# EAGLE design LEDBox (EAGLE 9.1.3)
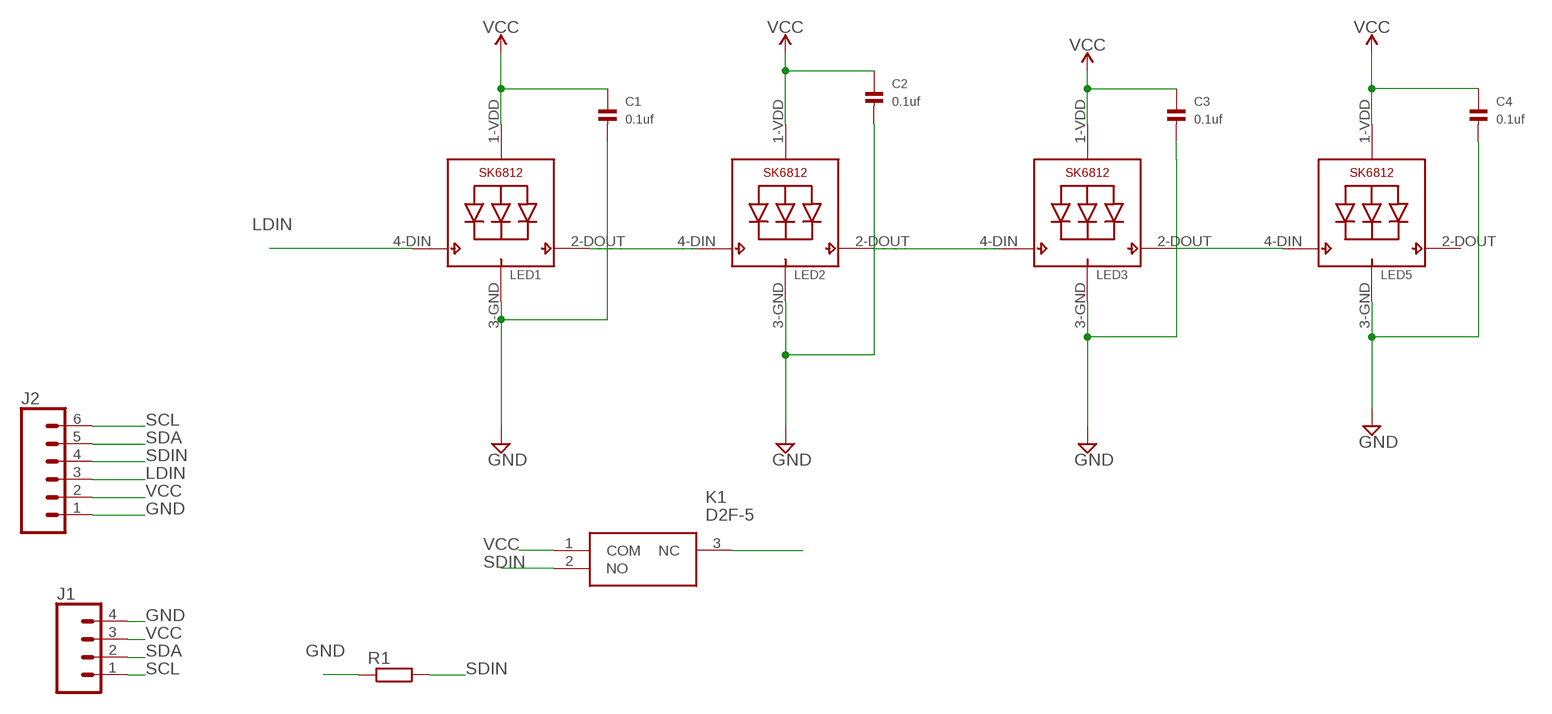
[diagram p0: schematic, sheet 1]

## Parts
C1  0.1uf  CAP_CERAMIC1206  [1206]
C2  0.1uf  CAP_CERAMIC1206  [1206]
C3  0.1uf  CAP_CERAMIC1206  [1206]
C4  0.1uf  CAP_CERAMIC1206  [1206]
J1  CONN_041X04_NO_SILK  [1X04_NO_SILK]
J2  CONN_06SMD-1MM  [1X06-1MM]
K1  D2F-5  [SHDR3W100P0X508_1X3_1280X580X5]
LED1  SK6812_5050  [LED5050]
LED2  SK6812_5050  [LED5050]
LED3  SK6812_5050  [LED5050]
LED5  SK6812_5050  [LED5050]
R1  RR3216  [R3216]

## Nets
GND: C1.2 C2.2 C3.2 C4.2 J1.4 J2.1 LED1.3-GND(GND) LED2.3-GND(GND) LED3.3-GND(GND) LED5.3-GND(GND) R1.1
LDIN: J2.3 LED1.4-DIN(DI)
N$1: LED1.2-DOUT(DO) LED2.4-DIN(DI)
N$2: LED2.2-DOUT(DO) LED3.4-DIN(DI)
N$3: LED3.2-DOUT(DO) LED5.4-DIN(DI)
N$6: K1.3(NC)
SCL: J1.1 J2.6
SDA: J1.2 J2.5
SDIN: J2.4 K1.2(NO) R1.2
VCC: C1.1 C2.1 C3.1 C4.1 J1.3 J2.2 K1.1(COM) LED1.1-VDD(VDD) LED2.1-VDD(VDD) LED3.1-VDD(VDD) LED5.1-VDD(VDD)
Unconnected: LED5.2-DOUT(DO)

## Library data of the parts
C1-C4 = microbuilder:CAP_CERAMIC: Ceramic Capacitors 0402 - 0402 Surface Mount Capacitors 16pF 50V 5% [Digikey: 445-4899-2-ND] 18pF 50V 5% [Digikey: 490-1281-2-ND] 22pF 50V 5% [Digikey: 490-1283-2-ND] 68pF 50V 5% [Digikey: 490-1289-2-ND] 0.1uF 10V 10% [Digikey: 490-1318-2-ND] 1.0uF 6.3V 10% [Digikey: 490-1320-2-ND] 0603 - 0603 Surface Mount Capacitors 16 pF 50V 5% [Digikey: 445-5051-2-ND] 22 pF 50V [Digikey: PCC220ACVTR-ND] 33 pF 50V 5% [Digikey: 490-1415-1-ND] 56pF 50V 5% [Digikey: 490-1421-1-ND] 220pF 50V 5% [Digikey: 445-1285-1-ND] 680 pF 50V 2200 pF 50V 5% C0G [Digikey: 445-1297-1-ND] 5600 pF 100V 5% X7R [Digikey: 478-3711-1-ND] 0.1 µF 25V 10% [Digikey: PCC2277TR-ND] 0.22 µF 16V 10% X7R [Digikey: 445-1318-1-ND] 1.0 µF 25V 10% [Digikey: 445-5146-2-ND] 0603 - RF Specific 3pF 250V +/-0.1pF RF [Digikey: 712-1347-1-ND] 18 pF 250V 5% [Digikey: 478-3505-1-ND or 712-1322-1-ND] 56 pF 250V 5% C0G RF [Digikey: 490-4867-1-ND] 68 pF 250V RF [Digikey: 490-4868-1-ND] 0805 - 0805 Surface Mount Capacitors 220 pF 250V 2% RF Ceramic Capacitor [Digikey: 712-1398-1-ND] 1000 pF 50V 2% NP0 Ceramic Capacitor [Digikey: 478-3760-1-ND] 0.1 µF 25V 10% Ceramic Capacitor [Digikey: PCC1828TR-ND] 1.0 µF 16V 10% Ceramic Capacitor[Digikey: 490-1691-2-ND] 10.0 µF 10V 10% Ceramic Capacitor[Digikey: 709-1228-1-ND] 10.0 uF 16V 10% Ceramic Capacitor [Digikey: 478-5165-2-ND] 47 uF 6.3V 20% Ceramic Capacitor [Digikey: 587-1779-1-ND or 399-5506-1-ND] 1206 - 1206 Surface Mount Capacitors 47uF 10V 20% Ceramic Capacitor [Digikey: 490-5528-1-ND or 399-5508-1-ND or 445-6010-1-ND] 100uF 6.3V -20%, +80% Y5V Ceramic Capacitor (Digikey: 490-4512-1-ND, Mouser: 81-GRM31CF50J107ZE1L)
J1 = SparkFun-Connectors:CONN_04: Multi connection point. Often used as Generic Header-pin footprint for 0.1 inch spaced/style header connections On any of the 0.1 inch spaced packages, you can populate with these: Break Away Headers - Straight <https://www.sparkfun.com/products/116> (PRT-00116) Break Away Male Headers - Right Angle <https://www.sparkfun.com/products/553> (PRT-00553) Female Headers <https://www.sparkfun.com/products/115> (PRT-00115) Break Away Headers - Machine Pin <https://www.sparkfun.com/products/117> (PRT-00117) Break Away Female Headers - Swiss Machine Pin <https://www.sparkfun.com/products/743> (PRT-00743) For SCREWTERMINALS and SPRING TERMINALS visit here: Screw Terimnals on SparkFun.com <https://www.sparkfun.com/search/results?term=Screw+Terminals> (5mm/3.5mm/2.54mm spacing) This device is also useful as a general connection point to wire up your design to another part of your project. Our various solder wires solder well into these plated through hole pads. Hook-Up Wire - Assortment (Stranded, 22 AWG) <https://www.sparkfun.com/products/11375> (PRT-11375) Hook-Up Wire - Assortment (Solid Core, 22 AWG) <https://www.sparkfun.com/products/11367> (PRT-11367) View the entire wire category on our website here <https://www.sparkfun.com/categories/141> Special notes: Molex polarized connector foot print use with SKU : PRT-08231 with associated crimp pins and housings. 1MM SMD Version SKU: PRT-10208; PROD_ID: CONN-09696
J2 = SparkFun-Connectors:CONN_06: Multi connection point. Often used as Generic Header-pin footprint for 0.1 inch spaced/style header connections On any of the 0.1 inch spaced packages, you can populate with these: Break Away Headers - Straight <https://www.sparkfun.com/products/116> (PRT-00116) Break Away Male Headers - Right Angle <https://www.sparkfun.com/products/553> (PRT-00553) Female Headers <https://www.sparkfun.com/products/115> (PRT-00115) Break Away Headers - Machine Pin <https://www.sparkfun.com/products/117> (PRT-00117) Break Away Female Headers - Swiss Machine Pin <https://www.sparkfun.com/products/743> (PRT-00743) Arduino Stackable Header - 6 Pin <https://www.sparkfun.com/products/9280> (PRT-09280) For SCREWTERMINALS and SPRING TERMINALS visit here: Screw Terimnals on SparkFun.com <https://www.sparkfun.com/search/results?term=Screw+Terminals> (5mm/3.5mm/2.54mm spacing) This device is also useful as a general connection point to wire up your design to another part of your project. Our various solder wires solder well into these plated through hole pads. Hook-Up Wire - Assortment (Stranded, 22 AWG) <https://www.sparkfun.com/products/11375> (PRT-11375) Hook-Up Wire - Assortment (Solid Core, 22 AWG) <https://www.sparkfun.com/products/11367> (PRT-11367) View the entire wire category on our website here <https://www.sparkfun.com/categories/141>; PROD_ID: CONN-08249; SF_ID: GPS-00579
K1 = D2F-5:D2F-5: OMRON ELECTRONIC COMPONENTS - D2F-5 - MICROSWITCH, PLUNGER, SPDT, 5A, 250V, TH Source: Datasheet <http://omronfs.omron.com/en_US/ecb/products/pdf/en-d2f.pdf>; ALLIED_NUMBER: 71203873; ALLIED_PRICE-STOCK: https://www.alliedelec.com/omron-electronic-components-d2f-5/71203873/; DESCRIPTION: OMRON ELECTRONIC COMPONENTS - D2F-5 - MICROSWITCH, PLUNGER, SPDT, 5A, 250V, TH; HEIGHT: 5.8mm; MANUFACTURER_NAME: Omron Electronics; MANUFACTURER_PART_NUMBER: D2F-5; MOUSER_PART_NUMBER: 653-D2F-5; MOUSER_PRICE-STOCK: https://www.mouser.com/Search/Refine.aspx?Keyword=653-D2F-5
LED1-LED3 LED5 = SK6812:SK6812
R1 = eagle-ltspice:R: RESISTOR, European symbol; SPICEMODEL: NONE; SPICEPREFIX: R

## Board
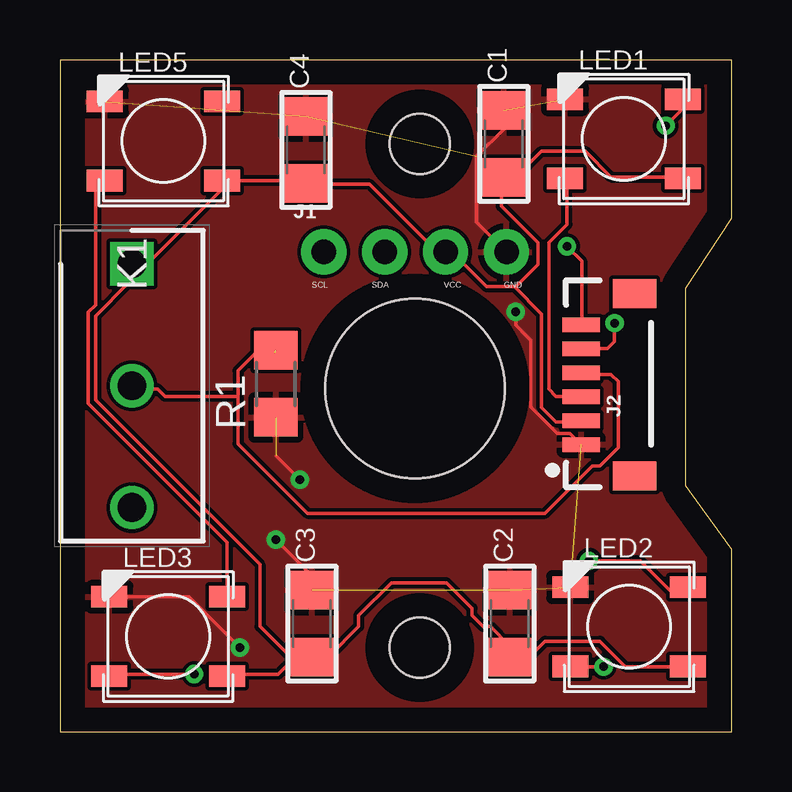
[diagram p1: board, top side]
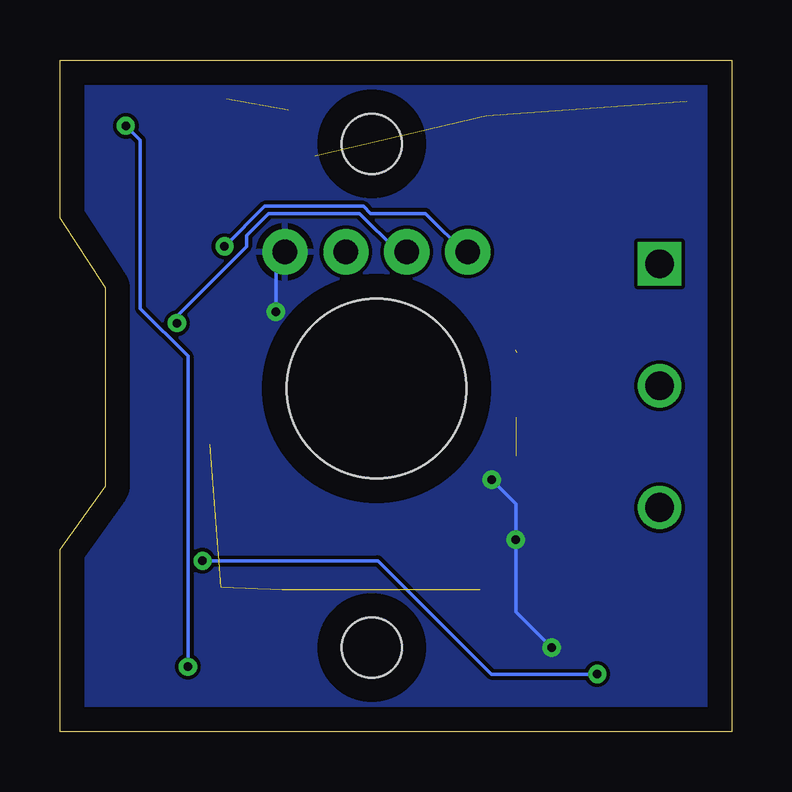
[diagram p2: board, bottom side, seen from below]

Size 28 x 28 mm. Coordinates in mm from the lower left corner, seen from the top.
Outline: 0,0 28,0 28,7.6 26.1,10.25 26.1,18.5 28,21.4 28,28 0,28 0,0
Copper layers (1*16): Top 0.035mm / dielectric 1.5mm / Bottom 0.035mm
Design rules "default": minimum track width 6mil, minimum drill 0.35mm, track to track 6mil, track to pad 6mil, pad to pad 6mil, via to via 6mil, smd to smd 6mil, copper to edge 40mil, drill to drill 6mil, minimum pad ring 10mil, minimum via ring 8mil, stop-mask expansion 4mil, vias tented up to drill 0mil, thermal gap 10mil
Holes 7.5 mm at 14.8,14.3
Holes 2.5 mm at 15,24.5 15,3.5

### Footprints (pad centres in the part's own frame; a part is rotated, then mirrored left to right if it is on the bottom)
1206 = smd 1.6 x 1.8: 1 -1.4,0; 2 1.4,0
1X04_NO_SILK = drill 1.016 pad 1.88: 1 0,0; 2 2.54,0; 3 5.08,0; 4 7.62,0
1X06-1MM = smd 0.6 x 1.55: 1 -2.54,1.27; 2 -1.54,1.27; 3 -0.54,1.27; 4 0.46,1.27; 5 1.46,1.27; 6 2.46,1.27 | smd 1.2 x 1.8: P$1 -3.84,-0.955; P$2 3.76,-0.955
SHDR3W100P0X508_1X3_1280X580X5 = drill 1.2 pad 1.8 square: 1 0,0 | drill 1.2 pad 1.8: 2 5.08,0; 3 10.16,0
LED5050 = smd 1.5 x 0.9: 1-VDD 2.45,-1.65; 2-DOUT 2.45,1.65; 3-GND -2.45,1.65; 4-DIN -2.45,-1.65
R3216 = smd 1.6 x 1.8: 1 -1.4,0; 2 1.4,0

### Placement (x,y rotation side)
C1  18.5,24.5 90 top
C2  18.75,4.5 90 top
C3  10.5,4.5 90 top
C4  10.25,24.25 90 top
J1  11,20 0 top
J2  23,14.5 90 top
K1  3,19.5 270 top
LED1  23.51,24.71 0 top
LED2  23.73,4.37 0 top
LED3  4.51,3.97 0 top
LED5  4.32,24.62 0 top
R1  9,14.5 90 top

### Tracks (layer width: path | path; a pad name or v marks a point on that pad's centre or on a via)
GND  (via drill 0.35)  (7 unrouted)
  Top 0.152: LED3.3-GND 5.38,5.62 v7.5,3.5 | v9,8 10.5,6.5 C3.2 | v10,10.5 9,11.5 | J2.1 21.26,12.43 20.73,12.43 19.64,13.52 19.64,16.31 19.47,16.47 | 19.47,16.47 19.4,16.55 | 19.47,16.47 19,16.95 v19,17.5 | C1.2 18.5,25.12 17.37,24 17.37,21.25 J1.4
  Bottom 0.152: v7.5,3.5 9,5 v9,8 9,9.5 v10,10.5 | v19,17.5 19,19.62 J1.4
  pour Bottom: 0,28 28.1,28 28.1,-0.1 0,-0.1
  pour Top: 0,28 28.5,28 28.5,21.5 28.5,-0.3 0,-0.3
LDIN
  Top 0.152: LED1.4-DIN 21.14,22.97 21.14,21.14 20.38,20.38 20.38,14.28 20.68,13.98 21.6,13.98 J2.3
N$1  (via drill 0.35)
  Top 0.152: v22.66,2.7 21.29,2.7 LED2.4-DIN | v25.26,25.26 25.86,25.86 25.86,26.32 LED1.2-DOUT
  Bottom 0.152: v22.66,2.7 22.66,15.65 24.65,17.64 24.65,24.65 v25.26,25.26
N$2  (via drill 0.35)
  Top 0.152: v5.6,2.4 2.09,2.4 LED3.4-DIN | v22.05,7.12 24.19,7.12 25.41,5.9 26.17,5.9 LED2.2-DOUT
  Bottom 0.152: v5.6,2.4 10.02,2.4 14.74,7.12 v22.05,7.12
N$3
  Top 0.152: LED3.2-DOUT 6.97,5.75 6.97,7.88 1.18,13.67 1.18,17.48 1.48,17.79 1.48,22.66 1.79,22.97 LED5.4-DIN
SCL  (via drill 0.35)
  Top 0.152: v21.14,20.23 21.75,19.62 21.75,17.03 J2.6
  Bottom 0.152: v21.14,20.23 19.46,21.9 15.35,21.9 15.04,21.6 12.76,21.6 11.08,19.92 J1.1
SDA  (via drill 0.35)
  Top 0.152: v23.12,17.03 23.12,16.26 22.82,15.96 21.75,15.96 J2.5
  Bottom 0.152: v23.12,17.03 23.12,17.33 20.23,20.23 20.23,20.68 19.31,21.6 15.5,21.6 13.98,20.07 13.67,20.07 J1.2
SDIN  (1 unrouted)
  Top 0.152: 7.42,13.98 7.42,15.04 8.19,15.81 8.95,15.81 | 7.42,13.98 7.42,12 10.32,9.1 20.23,9.1 22.21,11.08 22.51,11.08 23.27,11.84 23.27,14.59 22.97,14.89 21.75,14.89 J2.4 | 7.42,13.98 4.38,13.98 4.07,14.28 3,14.28 K1.2
VCC
  Top 0.152: 9.71,3 9.1,2.4 6.97,2.4 LED3.1-VDD | 9.71,3 10.47,3 C3.1 | LED2.1-VDD 26.17,2.7 23.58,2.7 22.51,3.77 20.23,3.77 19.62,3.16 18.86,3.16 C2.1 18.7,3.16 18.7,3.62 17.94,4.38 17.64,4.38 17.18,4.83 17.18,5.14 16.11,6.21 13.83,6.21 12.45,4.83 12.45,4.38 11.23,3.16 10.62,3.16 C3.1 | LED1.1-VDD 25.86,23.12 22.97,23.12 21.9,24.19 20.07,24.19 19.01,23.12 18.55,23.12 C1.1 | 18.94,18.55 20.07,17.42 20.07,13.52 20.68,12.91 21.6,12.91 J2.2 | 18.94,18.55 17.79,18.55 16.42,19.92 16.11,19.92 J1.3 | 18.4,22.51 18.4,22.97 C1.1 | 15.96,20.07 J1.3 | 15.96,20.07 15.65,20.07 12.91,22.82 10.32,22.82 C4.1 10.17,22.97 6.82,22.97 LED5.1-VDD 6.66,22.97 6.66,22.51 3.77,19.62 3,19.62 K1.1 2.85,19.46 2.85,18.7 1.48,17.33 1.48,13.83 8.34,6.97 8.34,4.38 9.71,3 | 15.96,20.07 J1.3 | 9.71,3 C3.1 | 18.4,22.51 18.4,21.9 19.92,20.38 19.92,19.46 19.01,18.55 18.94,18.55 | 18.4,22.51 C1.1

### Text on the board
tNames: SCL | SDA | VCC | GND